# Altium schematic sheet BTVN3.SchDoc
size A; SheetNumber: 1; SheetTotal: 1
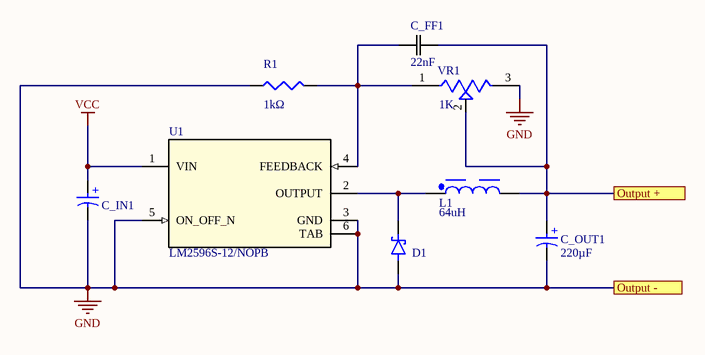
[diagram p0: BTVN3.SchDoc]

## Parts
C_FF1  22nF  [CAPC340180_88N_KEM _1206]
C_IN1  470µF  [WCAP-AS5H_D6.3H7.7]  (value not drawn)
C_OUT1  220µF  [WCAP-AS5H_D6.3H7.7]
D1  Diode Schottky  [SODFL4725X110N]  (value not drawn)
L1  64uH  [WE-PD_1210]
R1  1kΩ  [WRIS-PSMB_0603_L1.6W0.8H0.3]
U1  LM2596S-12/NOPB  [KTT0005B]
VR1  1K  [TRIM_3296W]

## Ports
Output +, Output -

## Nets
GND: C_IN1.2(N) C_OUT1.2(N) D1.A R1.1 U1.3(GND) U1.5(ON_OFF_N) U1.6(TAB) VR1.3(CW) ; port Output -
VCC: C_IN1.1(P) U1.1(VIN)
Output +: C_FF1.2 C_OUT1.1(P) L1.2 VR1.2(WIPER) ; port Output +
NetC_FF1_1: C_FF1.1 R1.2 U1.4(FEEDBACK) VR1.1(CCW)
NetD1_C: D1.C(K) L1.1 U1.2(OUTPUT)

## Notes on the sheet
- (in symbol Capacitor_Alumanium_SMD) +

## Library data of the parts
C_FF1 = Capacitor_SMD: No Description Available; Mfr_Name: Kemet; Manufacturer_Part_Number: C1206C104K5RACTU; Copyright: Copyright (C) 2023 Ultra Librarian. All rights reserved.; RefDes: RefDes; Type: DEV
C_IN1 C_OUT1 = Capacitor_Alumanium_SMD: WCAP-AS5H Aluminum Electrolytic Capacitor, V-Chip, D10 x H10.5mm, 330µF, 50V; Manufacturer Part Number: 865230657014; Manufacturer: Wurth Elektronik; Capacitance Tolerance: +/-20%; Dissipation Factor: 12%; Endurance: 5000h; Leakage Current: 165µA; Ripple Current: 900mA; Technical Reference: ASEF105331M050DVCTEE000; Category: Aluminum Electrolytic Capacitors; Match Code: WCAP-AS5H; ComponentLink1Description: Website Link; ComponentLink1URL: https://www.we-online.com/redexpert/article/865230657014?ad; ComponentLink2Description: Datasheet Link; ComponentLink2URL: https://www.we-online.com/redexpert/spec/865230657014?ad; Mount: Surface Mount; Operating Temperature Max: 105°C; Operating Temperature Min: -55°C; Packaging: Tape and Reel; Height: 10.5mm; Diameter: 10mm; Capacitance: 330µF; Rated Voltage (DC): 50V
D1 = Diode Schottky: Diode Schottky ?V ?A Surface Mount SMC; MP: MBRS320T3G; MF: ON Semiconductor; Package: DO-214 ON Semiconductor; Availability: Good; Arrow_Electronics-Purchase-URL: https://snapeda.com/shop?store=Arrow+Electronics&id=432205; SnapEDA_Link: https://www.snapeda.com/parts/MBRS320T3G/ON%20Semiconductor/view-part/432205/?ref=snap; DigiKey-Purchase-URL: https://snapeda.com/shop?store=DigiKey&id=432205; Mouser-Purchase-URL: https://snapeda.com/shop?store=Mouser&id=432205; Value: *; Price: None
L1 = Inductor_SMD: WE-PD SMT Power Inductor, size ?, ?uH, ?A, ?Ohm; Manufacturer Part Number: 7447709152; Manufacturer: Wurth Elektronik; Case/Size Code: 1210; DC Resistance: 1800mOhm; DC Resistance Max: 2300mOhm; Inductance: 1500uH; Rated Current: 0.8A; Self Resonant Frequency: 0.9MHz; Type: Standard; Category: Power Inductors; Match Code: WE-PD; ComponentLink1Description: Website Link; ComponentLink1URL: https://www.we-online.com/redexpert/article/7447709152?ad; ComponentLink2Description: Datasheet Link; ComponentLink2URL: https://www.we-online.com/redexpert/spec/7447709152?ad; Mount: Surface Mount; Operating Temperature Max: 125°C; Operating Temperature Min: -40°C; Packaging: Tape and Reel; Length: 12mm; Width: 12mm; Height: 10mm; Saturation Current: 0.8A
R1 = Resistor_SMD: WRIS-PSMC Metal Plate Resistor, SMT, size 2512, 2W, 5mΩ, +/-1%; Manufacturer Part Number: 580070763005; Manufacturer: Wurth Elektronik; Case/Size Code: 2512; Rated Current: 20A; Technical Reference: MC2512R005F201KAATE0000; Temperature Coefficient of Resistance: +/-100ppm/°C; Category: Metal Plate Resistors; Match Code: WRIS-PSMC; ComponentLink1Description: Website Link; ComponentLink1URL: https://www.we-online.com/redexpert/article/580070763005?ad; ComponentLink2Description: Datasheet Link; ComponentLink2URL: https://www.we-online.com/redexpert/spec/580070763005?ad; Mount: Surface Mount; Operating Temperature Max: 155°C; Operating Temperature Min: -55°C; Packaging: Tape and Reel; Length: 6.3mm; Width: 3.1mm; Height: 0.51mm; Rated Power: 2W; Resistance: 5mΩ; Resistance Tolerance: +/-1%
U1 = LM2596S-12/NOPB: No Description Available; Mfr_Name: Texas Instruments; PartNumber: LM2596SX-ADJ/NOPB; Alternate_PartNumber: LM2596S-ADJ/NOPB; CompType: IC; Type: DEV; RefDes: RefDes; Copyright: Copyright (C) 2023 Ultra Librarian. All rights reserved.; Manufacturer_Part_Number: LM2596S-12/NOPB; PackageReference: KTT0005B; MountType: SMT; RoHS: Y; Manufacturer: Texas Instruments
VR1 = Variable_Resistor: ? Ohms 0.75W, 3/4W PC Pins Panel Mount, Through Hole Trimmer Potentiometer Cermet 15.0 Turn Side Adjustment; MF: Bourns; MP: 3006P-1-202; Check_prices: https://www.snapeda.com/parts/3006P-1-202/Bourns/view-part/?ref=eda; SnapEDA_Link: https://www.snapeda.com/parts/3006P-1-202/Bourns/view-part/?ref=snap; Price: None; Value: *; Availability: In Stock; Package: NON-STANDARD-3 Bourns; Purchase-URL: https://pricing.snapeda.com/search/part/3006P-1-202/?ref=eda